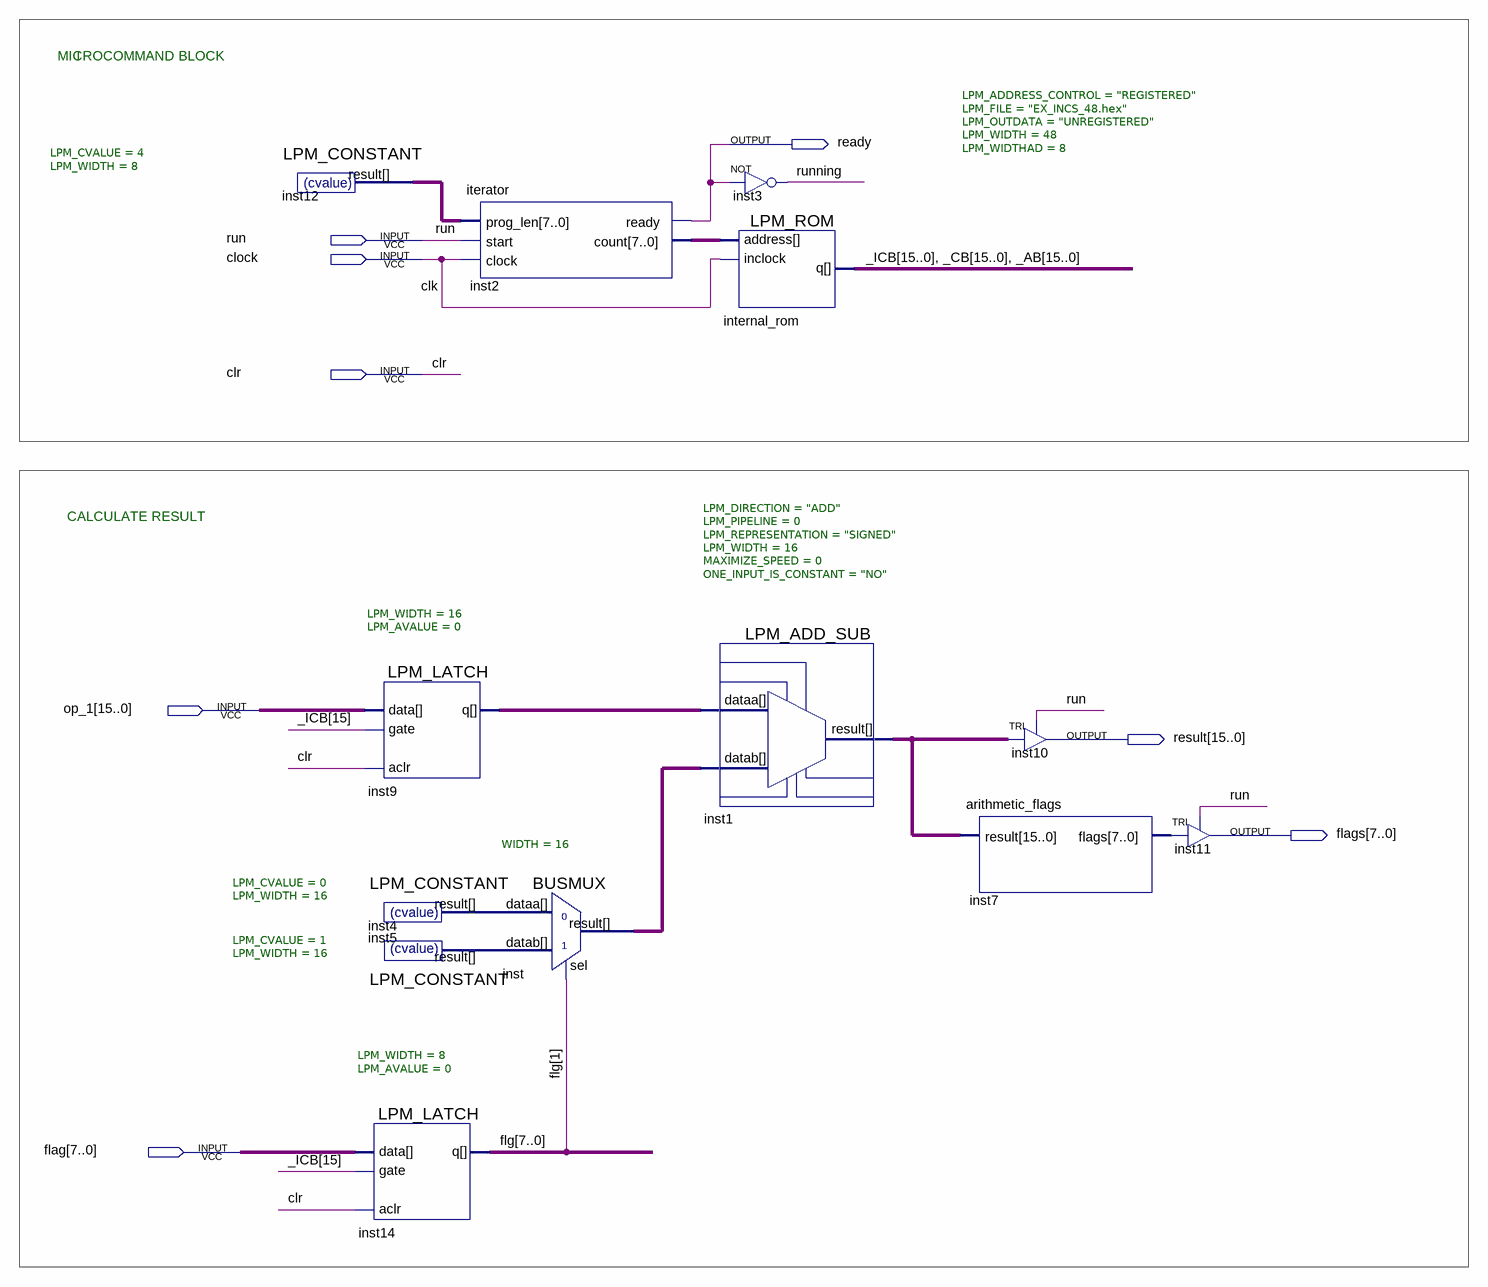
[diagram p0: schematic sheet]
// Quartus schematic EX_INCS.bdf as structural Verilog: 13 symbols, 8 pins
module EX_INCS (
  input  run,
  input  clock,
  input  clr,
  input  [15:0] op_1,
  input  [7:0] flag,
  output ready,
  output [15:0] result,
  output [7:0] flags
);

  wire running;
  wire [7:0] flg, inst2_count, inst7_flags, inst12_result;
  wire [15:0] _AB, _CB, _ICB, inst1_result, inst4_result, inst5_result, inst9_q, inst_result;

  LPM_CONSTANT #(.LPM_CVALUE(4), .LPM_WIDTH(8)) inst12 (.result(inst12_result));
  LPM_LATCH #(.LPM_WIDTH(16), .LPM_AVALUE(0)) inst9 (.aclr(clr), .data(op_1), .gate(_ICB[15]), .q(inst9_q));
  LPM_CONSTANT #(.LPM_CVALUE(0), .LPM_WIDTH(16)) inst4 (.result(inst4_result));
  LPM_CONSTANT #(.LPM_CVALUE(1), .LPM_WIDTH(16)) inst5 (.result(inst5_result));
  LPM_LATCH #(.LPM_WIDTH(8), .LPM_AVALUE(0)) inst14 (.aclr(clr), .data(flag), .gate(_ICB[15]), .q(flg));
  iterator inst2 (.prog_len(inst12_result), .start(run), .clock(clock), .ready(ready), .count(inst2_count));
  BUSMUX #(.WIDTH(16)) inst (.datab(inst5_result), .sel(flg[1]), .dataa(inst4_result), .result(inst_result));
  not inst3 (running, ready);
  LPM_ROM #(.LPM_ADDRESS_CONTROL("REGISTERED"), .LPM_FILE("EX_INCS_48.hex"), .LPM_OUTDATA("UNREGISTERED"), .LPM_WIDTH(48), .LPM_WIDTHAD(8)) internal_rom (
    .address(inst2_count), .inclock(clock), .q({_ICB, _CB, _AB}));
  LPM_ADD_SUB #(.LPM_DIRECTION("ADD"), .LPM_PIPELINE(0), .LPM_REPRESENTATION("SIGNED"), .LPM_WIDTH(16), .MAXIMIZE_SPEED(0), .ONE_INPUT_IS_CONSTANT("NO")) inst1 (
    .datab(inst_result), .dataa(inst9_q), .result(inst1_result));
  arithmetic_flags inst7 (.result(inst1_result), .flags(inst7_flags));
  TRI inst10[15:0] (.IN(inst1_result), .OE(run), .OUT(result));
  TRI inst11[7:0] (.IN(inst7_flags), .OE(run), .OUT(flags));

  // Other names for the same wires on the sheet: clk = clock

  // Notes on the sheet:
  //   MICROCOMMAND BLOCK
  //   I
  //   CALCULATE RESULT
endmodule
